# EasyEDA Pro project nb_watch.eprj

# Schematic Schematic1
Create Date: 2023-02-22; Page Name: P1; Project Name: nb_watch; Schematic Name: Schematic1; Update Date: 2023-02-22; Company: 嘉立创EDA; Page Size: A4; Version: V1.0
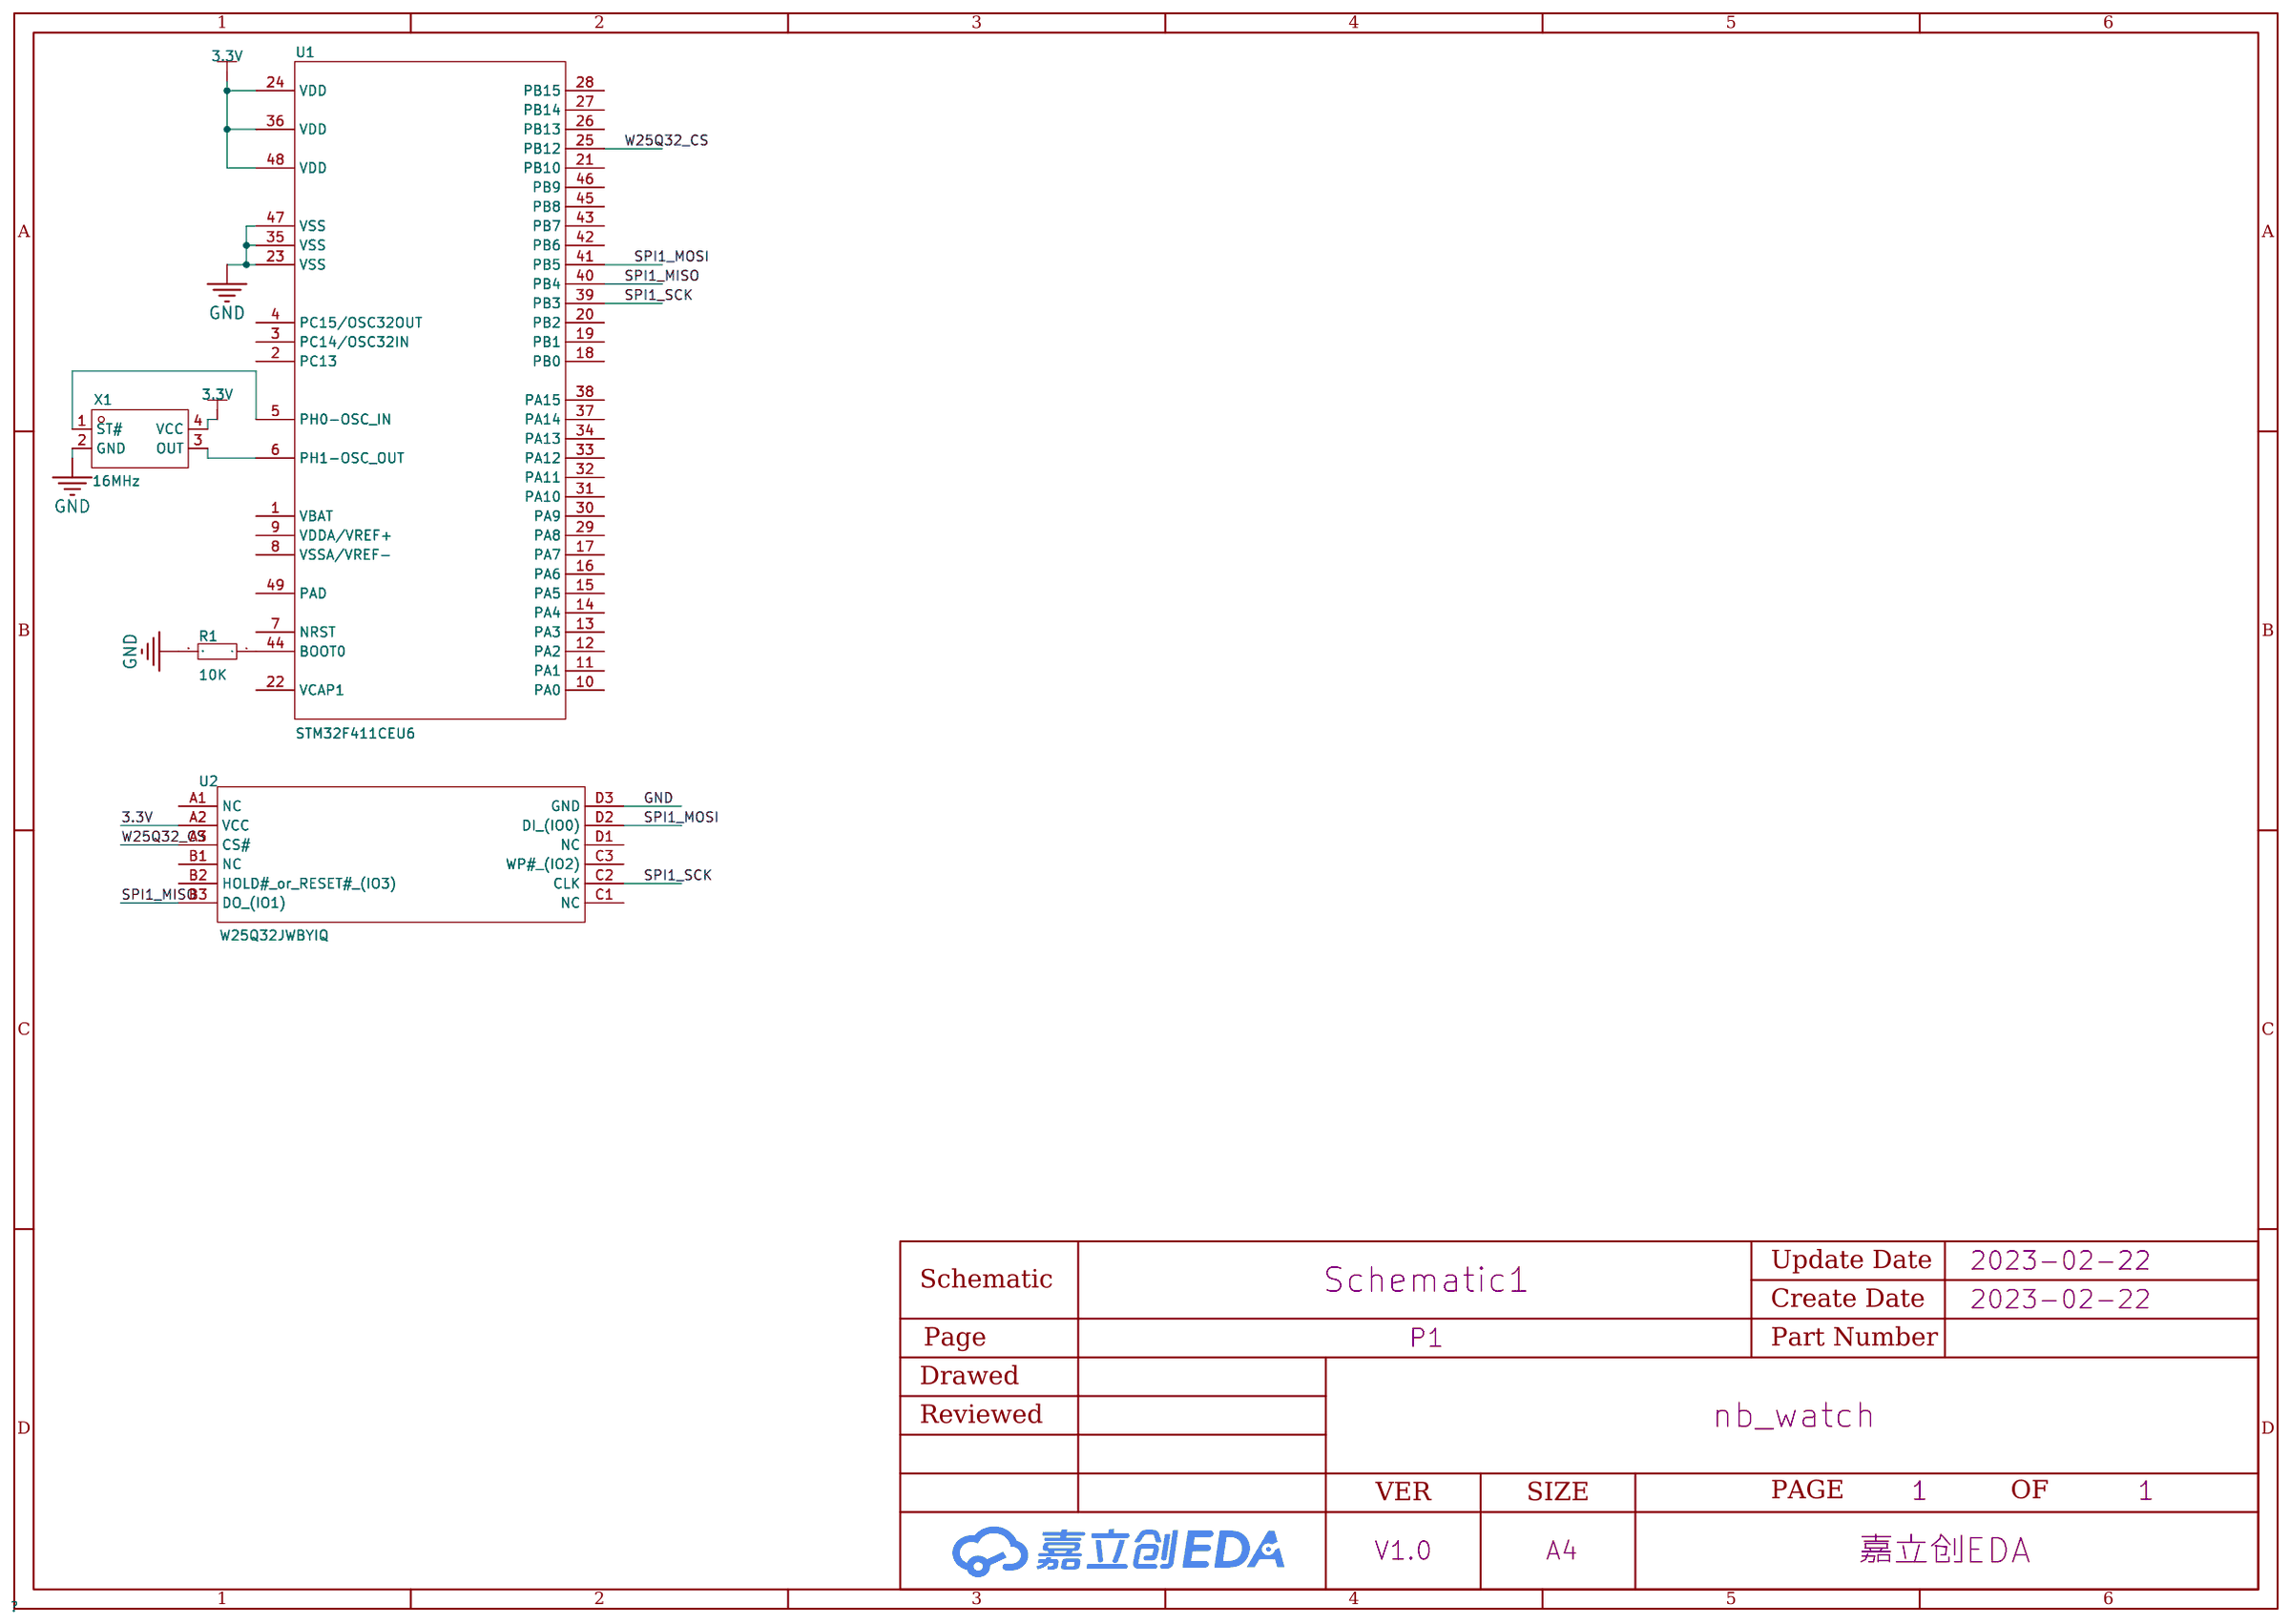
[diagram p0: schematic sheet]

## Parts
R1  10K  [R0603]
U1  STM32F411CEU6  [UFQFPN-48_L7.0-W7.0-P0.50-BL-EP]
U2  W25Q32JWBYIQ  [WLCSP-12_L2.3-W2.0-R4-C3-P0.50-TL]
X1  16MHz  [OSC-SMD_4P-L3.2-W2.5-BL]

## Library data of the parts
R1 = Res_0603: Supplier Footprint: 0603
U1 = STM32F411CEU6: CPU内核:ARM Cortex-M4;CPU最大主频:100MHz;工作电压范围:1.7V~3.6V;内部振荡器:有;程序 FLASH容量:512K@x8bit;RAM总容量:128KB;EEPROM/数据 FLASH容量:-;GPIO端口数量:36;ADC(单元数/通道数/位数):1@x10ch/12bit;外设/功能/协议栈:欠压检测/复位；DMA；看门狗；POR；PWM;工作温度范围:-40℃~+85℃;; LCSC Part Name: ARM Cortex-M4 100MHz 闪存：512K@x8bit RAM：128KB; Supplier Part: C60420; Manufacturer: ST(意法半导体); Supplier Footprint: UFQFPN-48; JLCPCB Part Class: Extended Part; Datasheet: https://atta.szlcsc.com/upload/public/pdf/source/20151026/1457707507170.pdf; Supplier: LCSC; CPU Core: ARM Cortex-M4; Maximum Frequency: 100MHz; Supply Voltage Range: 1.7V~3.6V; Internal Oscillator: 有; Program FLASH Size: 512K@x8bit; RAM Size: 128KB; GPIO Ports Number: 36; ADC (Units/Channels/bits): 1@x10ch/12bit; Peripherals / Functions / Protocol Stacks: 欠压检测/复位；DMA；看门狗；POR；PWM; Operating Temperature Range: -40℃~+85℃
U2 = W25Q32JWBYIQ: Supplier Part: C976194; Manufacturer: WINBOND(华邦); Supplier Footprint: WLCSP-12; JLCPCB Part Class: Extended Part; Datasheet: https://atta.szlcsc.com/upload/public/pdf/source/20201217/C1021789_51B18C456BF293544459C40404FB18EF.pdf; Supplier: LCSC
X1 = Q33310F70049000: 工作电压:3.3V;工作电源电流（最大值）:2.5mA;主频:24MHz;; LCSC Part Name: SG-310SCF 24MHZ 3.3V -40~+85℃ L; Supplier Part: C32528; Manufacturer: EPSON(爱普生); Supplier Footprint: SMD-3225_4P; JLCPCB Part Class: Extended Part; Datasheet: https://atta.szlcsc.com/upload/public/pdf/source/20161110/1478747427028.pdf; Supplier: LCSC; Voltage - Supply: 3.3V; Current - Supply (Max): 2.5mA; Operating Temperature: -40℃~85℃

## Nets
3.3V: U1.24(VDD) U1.36(VDD) U1.48(VDD) U2.A2(VCC) X1.4(VCC)
GND: R1.2 U1.23(VSS) U1.35(VSS) U1.47(VSS) U2.D3(GND) X1.2(GND)
SPI1_MISO: U1.40(PB4) U2.B3(DO (IO1))
SPI1_MOSI: U1.41(PB5) U2.D2(DI (IO0))
SPI1_SCK: U1.39(PB3) U2.C2(CLK)
W25Q32_CS: U1.25(PB12) U2.A3(CS#)
$1N1484: R1.1 U1.44(BOOT0)
$1N1622: U1.6(PH1-OSC_OUT) X1.3(OUT)
$1N1630: U1.5(PH0-OSC_IN) X1.1(ST#)

Not connected (* = marked no-connect by the designer): U1 1(VBAT) 2(PC13) 3(PC14/OSC32IN) 4(PC15/OSC32OUT) 7(NRST) 8(VSSA/VREF-) 9(VDDA/VREF+) 10(PA0) 11(PA1) 12(PA2) 13(PA3) 14(PA4) 15(PA5) 16(PA6) 17(PA7) 18(PB0) 19(PB1) 20(PB2) 21(PB10) 22(VCAP1) 26(PB13) 27(PB14) 28(PB15) 29(PA8) 30(PA9) 31(PA10) 32(PA11) 33(PA12) 34(PA13) 37(PA14) 38(PA15) 42(PB6) 43(PB7) 45(PB8) 46(PB9) 49(PAD); U2 A1(NC) B1(NC) B2(HOLD# or RESET# (IO3)) C1(NC) C3(WP# (IO2)) D1(NC)

# Board PCB1
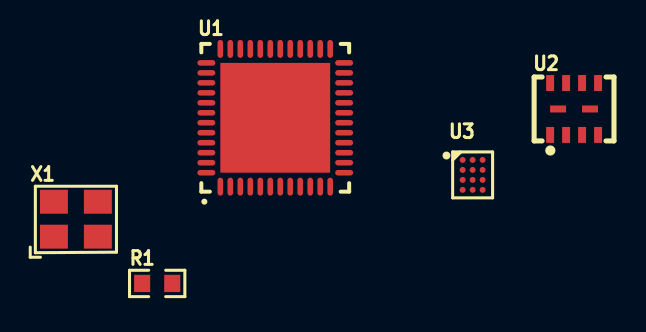
[diagram p1: board, top side]
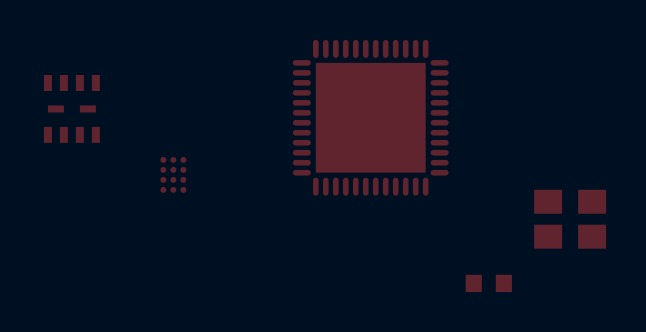
[diagram p2: board, bottom side, seen from below]

No outline. copper layers: Top Layer, Bottom Layer. Coordinates in mm from the lowest, leftmost part position.
Stack: Top Layer 0.035mm / Dielectric1 1.51mm FR4 er 4.5 / Bottom Layer 0.035mm

## Design rules (mm)
spacing safeClearance (default): track to track 0.152, other pairs 0.152 to 0.3
track width trackWidth (default): min 0.127, default 0.254, max 2.54
differential pair differentialPair (default): width min 0.127, default 0.254, max 2.54; gap min 0.152, default 0.152
via viaSize (default): diameter min 0.5, default 0.61, max 10; hole min 0.3, default 0.305, max 6

## Placement (name value [footprint] x y rotation side)
R1  10K  [R0603]  4.07 0 0 top
U1  STM32F411CEU6  [UFQFPN-48_L7.0-W7.0-P0.50-BL-EP]  9.98 8.3 0 top
U2  W25Q32JWBYIQ  [USON-8_L4.0-W3.0-P0.80-BL_WINBOND_UU]  24.94 8.74 0 top
U3  W25Q32JWBYIQ  [WLCSP-12_L2.3-W2.0-R4-C3-P0.50-TL]  19.86 5.44 0 top
X1  16MHz  [OSC-SMD_4P-L3.2-W2.5-BL]  0 3.22 0 top

## Footprints (pads in the part's own frame, mm; a bottom-side part is the same pattern mirrored in y, then rotated)
OSC-SMD_4P-L3.2-W2.5-BL
  rect 1.4x1.2 smd: 1(-1.1,-0.875) 2(1.1,-0.875) 3(1.1,0.875) 4(-1.1,0.875)
R0603
  rect 0.806x0.864 smd: 1(-0.753,0) 2(0.753,0)
UFQFPN-48_L7.0-W7.0-P0.50-BL-EP
  oval 0.28x0.9 smd: 1(-2.751,-3.45) 2(-2.251,-3.45) 3(-1.75,-3.45) 4(-1.25,-3.45) 5(-0.749,-3.45) 6(-0.249,-3.45) 7(0.249,-3.45) 8(0.75,-3.45) 9(1.25,-3.45) 10(1.75,-3.45) 11(2.251,-3.45) 12(2.751,-3.45) 25(2.751,3.449) 26(2.251,3.449) 27(1.75,3.449) 28(1.25,3.449) 29(0.75,3.449) 30(0.249,3.449) 31(-0.249,3.449) 32(-0.749,3.449) 33(-1.25,3.449) 34(-1.75,3.449) 35(-2.251,3.449) 36(-2.751,3.449)
  oval 0.9x0.28 smd: 13(3.45,-2.751) 14(3.45,-2.251) 15(3.45,-1.75) 16(3.45,-1.25) 17(3.45,-0.75) 18(3.45,-0.249) 19(3.45,0.249) 20(3.45,0.749) 21(3.45,1.25) 22(3.45,1.75) 23(3.45,2.251) 24(3.45,2.751) 37(-3.449,2.751) 38(-3.449,2.251) 39(-3.449,1.75) 40(-3.449,1.25) 41(-3.449,0.749) 42(-3.449,0.249) 43(-3.449,-0.249) 44(-3.449,-0.75) 45(-3.449,-1.25) 46(-3.449,-1.75) 47(-3.449,-2.251) 48(-3.449,-2.751)
  rect 5.5x5.5 smd: 49(0,0)
USON-8_L4.0-W3.0-P0.80-BL_WINBOND_UU
  rect 0.4x0.8 smd: 1(-1.2,-1.3) 2(-0.4,-1.3) 3(0.4,-1.3) 4(1.2,-1.3) 5(1.2,1.3) 6(0.4,1.3) 7(-0.4,1.3) 8(-1.2,1.3)
  rect 0.8x0.35 smd: 9(-0.802,0) 10(0.798,0)
WLCSP-12_L2.3-W2.0-R4-C3-P0.50-TL
  round 0.3 smd: A1(-0.5,0.75) A2(0,0.75) A3(0.5,0.75) B1(-0.5,0.25) B2(0,0.25) B3(0.5,0.25) C1(-0.5,-0.25) C2(0,-0.25) C3(0.5,-0.25) D1(-0.5,-0.75) D2(0,-0.75) D3(0.5,-0.75)

## Nets
3.3V: U1.24 U1.36 U1.48 U2.8 X1.4
GND: R1.2 U1.23 U1.35 U1.47 U2.4 X1.2
SPI1_MISO: U1.40 U2.2
SPI1_MOSI: U1.41 U2.5
SPI1_SCK: U1.39 U2.6
W25Q32_CS: U1.25 U2.1
$1N1484: R1.1 U1.44
$1N1622: U1.6 X1.3
$1N1630: U1.5 X1.1

Pads without a net: U1 1 2 3 4 7 8 9 10 11 12 13 14 15 16 17 18 19 20 21 22 26 27 28 29 30 31 32 33 34 37 38 42 43 45 46 49; U2 3 7 9 10; U3 A1 A2 A3 B1 B2 B3 C1 C2 C3 D1 D2 D3
